# EAGLE design modular-main (EAGLE 9.2.2)
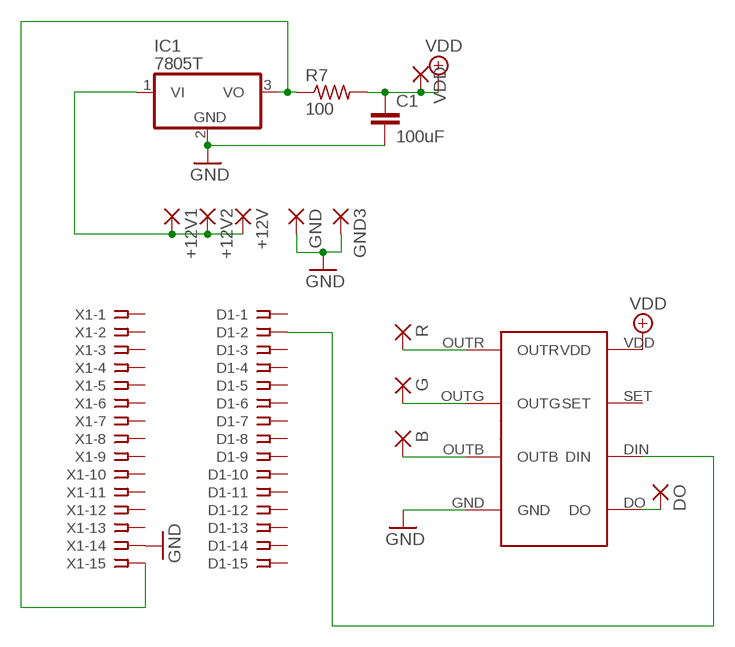
[diagram p0: schematic, sheet 1]

## Parts
0  WS2811  [SOP8]
+12V  SMD5  [SMD2,54-5,08]
+12V1  SMD5  [SMD2,54-5,08]
+12V2  SMD5  [SMD2,54-5,08]
B  SMD5  [SMD2,54-5,08]
C1  100uF  C-EUC0805  [C0805]
D1  SSW-115-02-G-S  [SSW-115-02-G-S]
DO  SMD5  [SMD2,54-5,08]
G  SMD5  [SMD2,54-5,08]
GND  SMD5  [SMD2,54-5,08]
GND3  SMD5  [SMD2,54-5,08]
IC1  7805T  [TO220H]
R  SMD5  [SMD2,54-5,08]
R7  100  R-US_R0805  [R0805]
VDD  SMD5  [SMD2,54-5,08]
X1  SSW-115-02-G-S  [SSW-115-02-G-S]

## Nets
+5V: 0.VDD C1.1 R7.2 VDD.1(P) ; supply symbol labelled VDD
GND: 0.GND C1.2 GND3.1(P) GND.1(P) IC1.2(GND) X1.14
N$1: 0.DIN D1.2
N$2: 0.DO DO.1(P)
N$3: 0.OUTB B.1(P)
N$4: 0.OUTG G.1(P)
N$5: 0.OUTR R.1(P)
N$28: IC1.3(VO) R7.1 X1.15
N$29: +12V1.1(P) +12V2.1(P) +12V.1(P) IC1.1(VI)
Unconnected: 0.SET D1.1 D1.3 D1.4 D1.5 D1.6 D1.7 D1.8 D1.9 D1.10 D1.11 D1.12 D1.13 D1.14 D1.15 X1.1 X1.2 X1.3 X1.4 X1.5 X1.6 X1.7 X1.8 X1.9 X1.10 X1.11 X1.12 X1.13

## Library data of the parts
0 = ws2811:WS2811
+12V +12V1 +12V2 B DO G GND GND3 R VDD = wirepad:SMD5: SMD PAD
C1 = rcl:C-EU: CAPACITOR, European symbol; SPICEPREFIX: C
D1 X1 = con-samtec:SSW-115-02-G-S: THROUGH-HOLE .025" SQ POST SOCKET Source: Samtec SSW.pdf; MF: Samtec Inc.; MPN: SSW-115-02-G-S; OC_FARNELL: unknown; OC_NEWARK: 11P9564
IC1 = linear:78*: Positive VOLTAGE REGULATOR Source: http://cache.national.com/ds/LM/LM78L05.pdf http://www.fairchildsemi.com/ds/LM/LM7805.pdf
R7 = rcl:R-US_: RESISTOR, American symbol; SPICEPREFIX: R

## Board
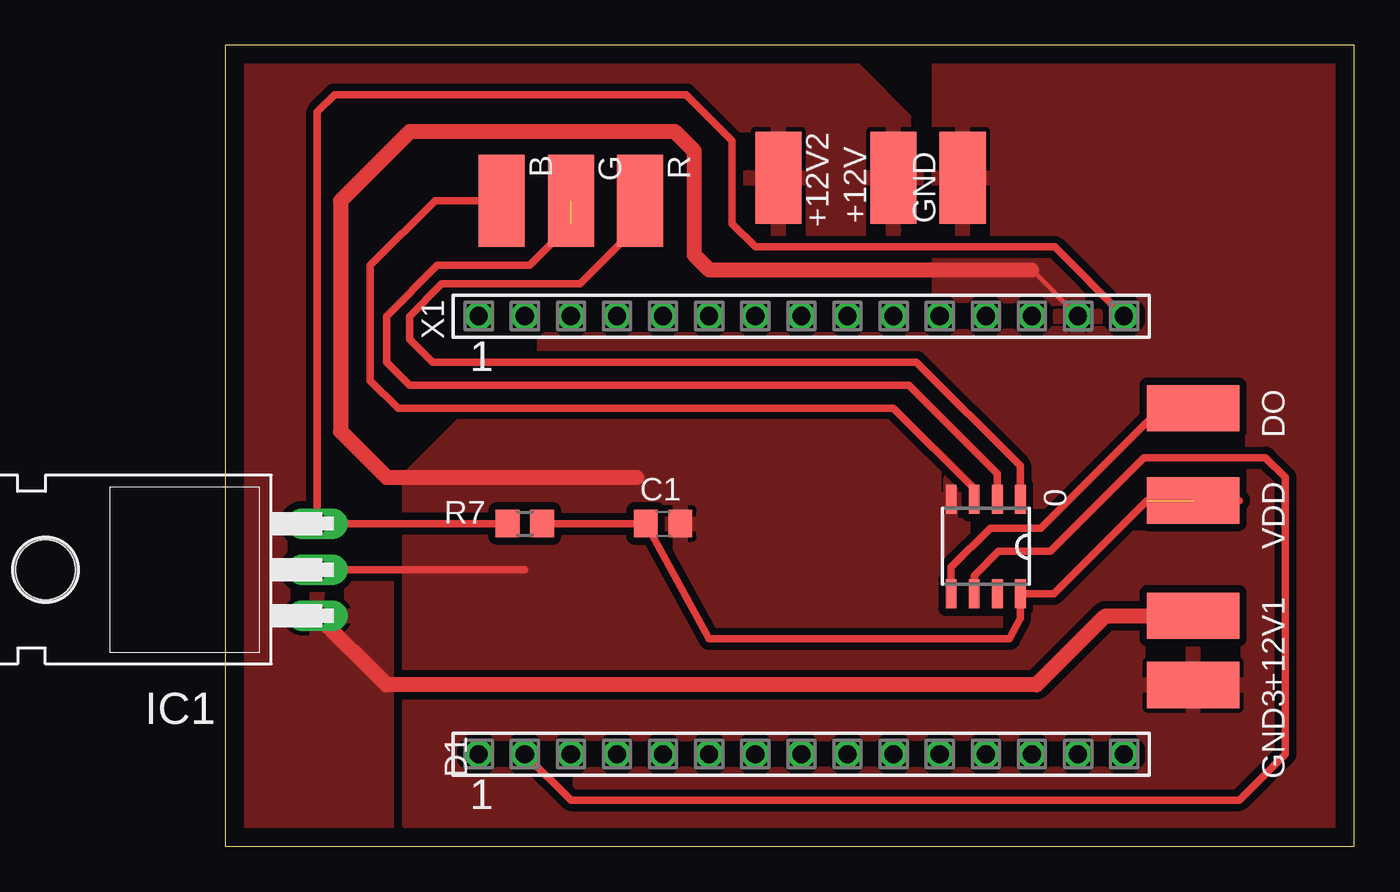
[diagram p1: board, top side]

Size 62.21 x 44.12 mm. Coordinates in mm from the lower left corner, seen from the top.
Outline: 0,0 62.21,0 62.21,44.12 0,44.12 0,0
Copper layers (1*16): Top 0.035mm / dielectric 1.5mm / Bottom 0.035mm
Design rules "default *": minimum track width 10mil, minimum drill 0.35mm, track to track 10mil, track to pad 10mil, pad to pad 10mil, via to via 10mil, smd to smd 10mil, copper to edge 40mil, drill to drill 10mil, minimum pad ring 10mil, minimum via ring 8mil, stop-mask expansion 2mil, vias tented up to drill 0mil, thermal gap 10mil

### Footprints (pad centres in the part's own frame; a part is rotated, then mirrored left to right if it is on the bottom)
SOP8 = smd 0.6 x 1.6: DIN 0.635,2.6; DO 1.905,2.6; GND 1.905,-2.6; OUTB 0.635,-2.6; OUTG -0.635,-2.6; OUTR -1.905,-2.6; SET -0.635,2.6; VDD -1.905,2.6
SMD2,54-5,08 = smd 2.54 x 5.08: 1 0,0
C0805 = smd 1.3 x 1.5: 1 -0.95,0; 2 0.95,0
SSW-115-02-G-S = drill 1 pad 1.5 octagon: 1 -17.78,0; 2 -15.24,0; 3 -12.7,0; 4 -10.16,0; 5 -7.62,0; 6 -5.08,0; 7 -2.54,0; 8 0,0; 9 2.54,0; 10 5.08,0; 11 7.62,0; 12 10.16,0; 13 12.7,0; 14 15.24,0; 15 17.78,0
TO220H = drill 1.118 long: 1 -2.54,-10.16; 2 0,-10.16; 3 2.54,-10.16 | hole 3.302: 0,4.826
R0805 = smd 1.3 x 1.5: 1 -0.95,0; 2 0.95,0

### Placement (x,y rotation side)
0  41.91,16.51 180 top
+12V  36.83,36.83 0 top
+12V1  53.34,12.7 90 top
+12V2  30.48,36.83 180 top
B  15.24,35.56 180 top
C1  24.13,17.78 0 top
D1  31.75,5.08 0 top
DO  53.34,24.13 90 top
G  19.05,35.56 180 top
GND  40.64,36.83 0 top
GND3  53.34,8.89 90 top
IC1  -5.08,15.24 90 top
R  22.86,35.56 180 top
R7  16.51,17.78 0 top
VDD  53.34,19.05 90 top
X1  31.75,29.21 0 top

### Tracks (layer width: path | path; a pad name or v marks a point on that pad's centre or on a via)
+5V  (1 unrouted)
  Top 0.406: 55.88,19.05 VDD.1 | 50.8,19.05 45.66,13.91 0.VDD 43.81,12.56 43.22,11.43 26.67,11.43 C1.1 R7.2
GND
  Top 0.254: 44.45,31.75 X1.14
  Top 0.406: IC1.2 16.51,15.24
  Top 0.813: 44.45,31.75 26.67,31.75 25.86,32.56 25.86,38.29 24.78,39.37 10.16,39.37 6.35,35.56 6.35,22.86 8.89,20.32 22.69,20.32 | 44.45,31.75
  pour Top (isolate 0.406): 39.37,33.02 39.37,43.18 41.91,45.72 62.23,45.72 63.5,44.45 64.77,43.18 64.77,-1.27 12.7,-1.27 10.16,1.27 10.16,20.32 17.78,27.94 39.37,27.94
N$1
  Top 0.406: D1.2 19.05,2.54 55.88,2.54 58.42,5.08 58.42,20.32 57.33,21.41 50.62,21.41 45.47,16.26 42.62,16.26 41.27,14.91 0.DIN
N$2
  Top 0.406: DO.1 51.56,24.13 44.96,17.53 42.16,17.53 40,15.37 0.DO 40.06,13.97
N$3
  Top 0.406: 0.OUTB 41.27,19.69 36.83,24.13 9.53,24.13 8,25.65 8,32 11.56,35.56 B.1
N$4  (1 unrouted)
  Top 0.406: 0.OUTG 42.54,20.53 37.68,25.4 10.16,25.4 8.89,26.67 8.89,29.21 11.68,32 16.76,32 19.05,34.29 18.28,34.29
N$5
  Top 0.406: 0.OUTR 43.81,20.95 38.1,26.67 35.56,26.67 | R.1 22.86,34.29 19.56,30.99 11.94,30.99 10.16,29.21 10.16,27.94 11.43,26.67 35.56,26.67 | 35.56,26.67
N$28
  Top 0.406: R7.1 IC1.3 5.08,40.45 6.03,41.4 25.4,41.4 27.94,38.86 27.94,34.29 29.21,33.02 45.72,33.02 X1.15
N$29
  Top 0.406: 52.07,12.7 +12V1.1
  Top 0.813: IC1.1 8.89,8.89 44.7,8.89 48.51,12.7 52.07,12.7
  pour Top (isolate 0.406): 8.89,-4.8 8.89,30.48 35.56,30.48 38.1,33.02 38.1,39.37 34.29,43.18 -1.27,43.18 -2.54,44.45 -2.54,-2.26